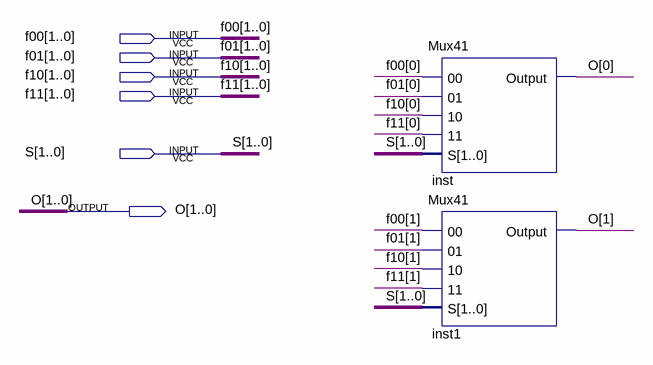
[diagram p0: schematic sheet]
// Quartus schematic mux41_2bit.bdf as structural Verilog: 2 symbols, 6 pins
module mux41_2bit (
  input  [1:0] f00,
  input  [1:0] f01,
  input  [1:0] f10,
  input  [1:0] f11,
  input  [1:0] S,
  output [1:0] O
);

  Mux41 inst (.\00 (f00[0]), .\01 (f01[0]), .\10 (f10[0]), .\11 (f11[0]), .S(S), .Output(O[0]));
  Mux41 inst1 (.\00 (f00[1]), .\01 (f01[1]), .\10 (f10[1]), .\11 (f11[1]), .S(S), .Output(O[1]));
endmodule
